# Altium schematic sheet gsm.SchDoc
size A; SheetNumber: 1; SheetTotal: 4
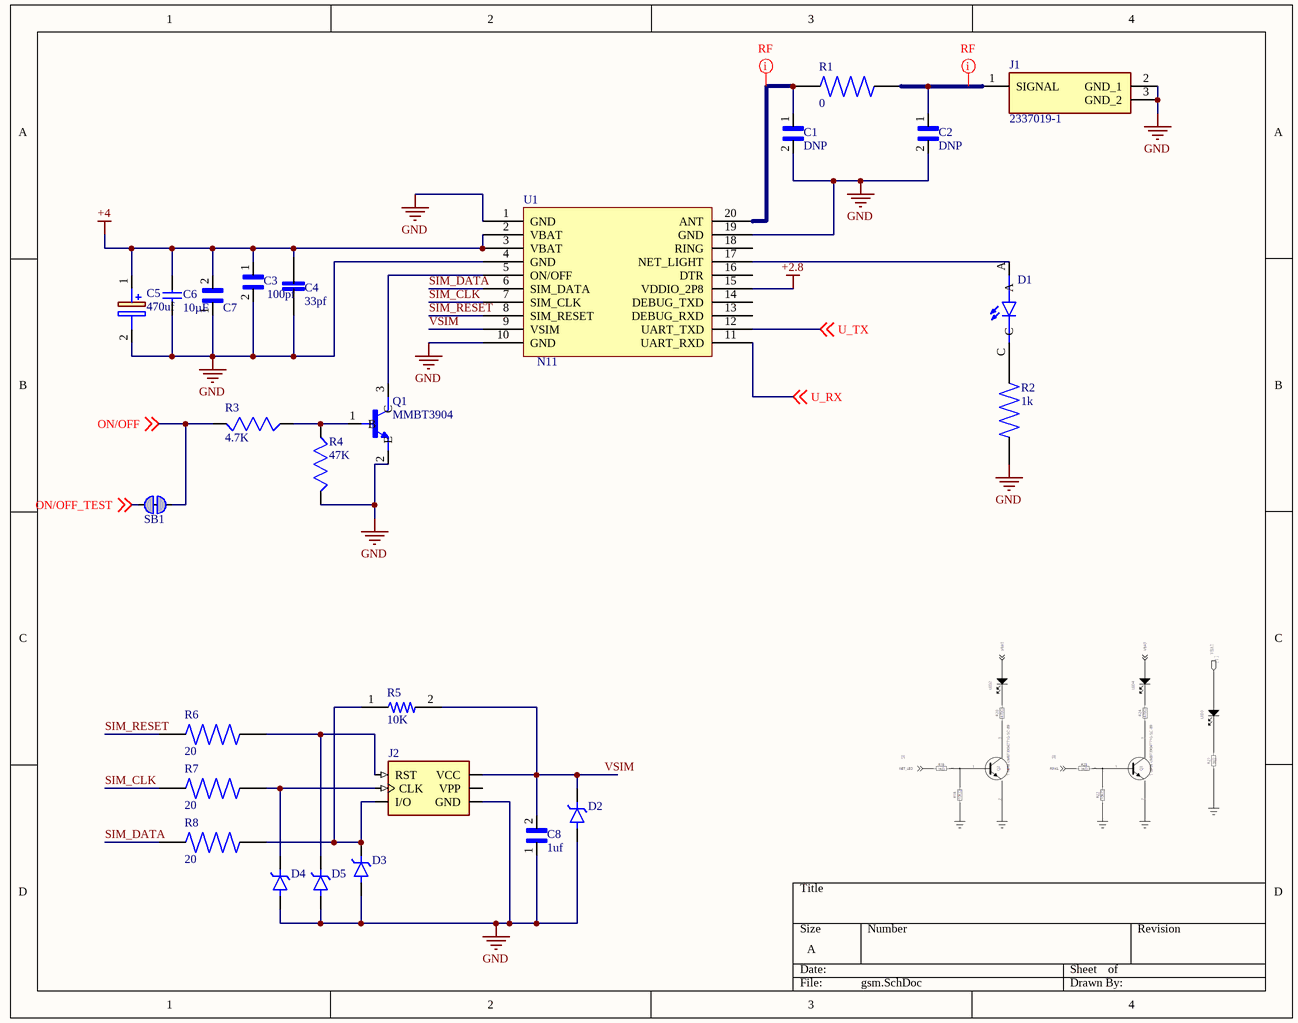
[diagram p0: gsm.SchDoc]

## Parts
C1  value DNP  [CAPC1608X90]  (hidden comment: C0603C474K8PACTU)
C2  value DNP  [CAPC1608X90]  (hidden comment: C0603C474K8PACTU)
C3  value 100pf  [CAPC1608X90]  (hidden comment: CC0603JPNPO9BN101)
C4  value 33pf  [CAPC1608X90]  (hidden comment: CC0603JPNPO9BN330)
C5  value 470uf  [CAPAE830X1050N]  (hidden comment: EDH477M6R3A9MAA)
C6  10µF  [CAP_0603]
C7  06033G104ZAT4A  [CAPC1608X90N]  (value not drawn)
C8  value 1uf  [CAPC1608X90N]  (hidden comment: EMK107B7105MA-T)
D1  LTST-C190KRKT  [LEDC1608X35N]  (value not drawn)
D2  ESD9X5.0ST5G  [SODFL1006X43N]  (value not drawn)
D3  ESD9X5.0ST5G  [SODFL1006X43N]  (value not drawn)
D4  ESD9X5.0ST5G  [SODFL1006X43N]  (value not drawn)
D5  ESD9X5.0ST5G  [SODFL1006X43N]  (value not drawn)
J1  2337019-1  [23370191]
J2  SIM8051-6-0-14-01-X-REVD  [GCT_SIM8051-6-0-14-01-X-REVD]  (value not drawn)
Q1  MMBT3904  [SOT95P240X120-3N]
R1  value 0  [RESC1607X60N]  (hidden comment: RC0603JR-070RL)
R2  value 1k  [RESC1608X55N]  (hidden comment: CR0603-FX-1001ELF)
R3  value 4.7K  [RESC1608X55]  (hidden comment: RC0603FR-0747KL)
R4  value 47K  [RESC1608X55]  (hidden comment: RC0603FR-0747KL)
R5  value 10K  [RESC1607X60N]  (hidden comment: RC0603FR-0710KL)
R6  value 20  [RESC1607X60N]  (hidden comment: RC0603FR-0720RL)
R7  value 20  [RESC1607X60N]  (hidden comment: RC0603FR-0720RL)
R8  value 20  [RESC1607X60N]  (hidden comment: RC0603FR-0720RL)
SB1  Solderbridge  [SOLDERBRIDGE_SHORTED]  (value not drawn)  (net tie, no BOM)
U1  This is Neoway N11 Module  [N11_20P]  (value not drawn)

## Nets
+2.8: U1.15(VDDIO_2P8)
+4: C3.1 C4.2 C5.1(+) C6.1 C7.2 U1.2(VBAT) U1.3(VBAT)
GND: C1.2 C2.2 C3.2 C4.1 C5.2(-) C6.2 C7.1 C8.1 D2.A D3.A D4.A D5.A J1.2(GND_1) J1.3(GND_2) J2.C5(GND) Q1.2(E) R2.1 R4.1 U1.1(GND) U1.4(GND) U1.10(GND) U1.19(GND)
ON/OFF: R3.1 SB1.1 ; off-sheet ON/OFF
ON/OFF_TEST: SB1.2 ; off-sheet ON/OFF_TEST
SIM_CLK: R7.1 U1.7(SIM_CLK)
SIM_DATA: R8.1 U1.6(SIM_DATA)
SIM_RESET: R6.1 U1.8(SIM_RESET)
U_RX: U1.11(UART_RXD) ; off-sheet U_RX
U_TX: U1.12(UART_TXD) ; off-sheet U_TX
VSIM: C8.2 D2.C(K) J2.C1(VCC) R5.2 U1.9(VSIM)
NetC1_1: C1.1 R1.1 U1.20(ANT)
NetC2_1: C2.1 J1.1(SIGNAL) R1.2
NetD1_A: D1.A U1.17(NET_LIGHT)
NetD1_C: D1.C R2.2
NetD3_C: D3.C(K) J2.C7(I/O) R5.1 R8.2
NetD4_C: D4.C(K) J2.C3(CLK) R7.2
NetD5_C: D5.C(K) J2.C2(RST) R6.2
NetQ1_1: Q1.1(B) R3.2 R4.2
NetQ1_3: Q1.3(C) U1.5(ON/OFF)

Not connected (* = marked no-connect by the designer): J2 C6(VPP); U1 13(DEBUG_RXD) 14(DEBUG_TXD) 16(DTR) 18(RING)

## Layout directives
net class RF: NetC1_1, NetC2_1

## Library data of the parts
C1 C2 = C0603C474K8PACTU: CAP, MLCC, X5R, 0.47UF, 10V, 0603; MF: {'manufacturer': u'KEMET'}; Availability: Unavailable; MP: C0603C474K8PACTU; Price: None; Package: None
C3 = CC0603JPNPO9BN101: 0603 100 pF 50 V Â±5% Tolerance NP0 SMT Multilayer Ceramic Capacitor; MF: {'manufacturer': u'Yageo'}; MP: CC0603JPNPO9BN101; Package: None; Price: None; Availability: Unavailable
C4 = CC0603JPNPO9BN330: 0603 33 pF 50 V Â±5 % Tolerance C0G/NP0 SMT Multilayer Ceramic Capacitor; MF: {'manufacturer': u'Yageo'}; Price: None; Package: None; Availability: Unavailable; MP: CC0603JPNPO9BN330
C5 = EDH477M6R3A9MAA: Capacitor Polarised; Manufacturer_Name: KEMET; Datasheet Link: https://content.kemet.com/datasheets/KEM_A4049_EDH.pdf; Height: 10.5mm; Manufacturer_Part_Number: EDH477M6R3A9MAA; Mouser Part Number: 80-EDH477M6R3A9MAA; Mouser Price/Stock: https://www.mouser.co.uk/ProductDetail/KEMET/EDH477M6R3A9MAA?qs=E9QF1UCAUX5I%2FnxgAi822A%3D%3D
C6 = CL10A106KP8NNNC: 10µF 10V Ceramic Capacitor X5R 0603 (1608 Metric) 0.063" L x 0.031" W (1.60mm x 0.80mm); Manufacturer: Samsung Electronics; Supplier 1: Digi-Key; Value: 10µF; Supplier Part Number 1: 1276-1192-1-ND; Part Number: CL10A106KP8NNNC
C7 = 06033G104ZAT4A: Cap Ceramic 0.1uF 25V Y5V -20% to 80% SMD 0603 85C T/R; MF: {'manufacturer': u'AVX'}; Availability: Unavailable; MP: 06033G104ZAT4A; Price: None; Package: None; Value: *
C8 = EMK107B7105MA-T: Ceramic Multilayer Capacitor; Capacitor Type:General Purpose; Capacitance:1ÂµF; Capacitance Tolerance:Â± 20%; Voltage Rating:16VDC; Capacitor Dielectric Type:Multilayer Ceramic; Package/Case:0603; Termination Type:SMD ;RoHS Compliant: Yes; MF: {'manufacturer': u'Taiyo Yuden'}; Price: None; Availability: Unavailable; MP: EMK107B7105MA-T; Package: None
D1 = LTST-C190KRKT: LED; SMD; 0603; red; 18-180mcd; 1.6x0.8x0.8mm; 130Â°; 1.6Ã·2.4V; 20mA; MF: {'manufacturer': u'Lite-On Inc.'}; Price: None; Package: None; Availability: Unavailable; MP: LTST-C190KRKT
D2-D5 = ESD9X5.0ST5G: ESD9X5.0S: ESD Protection Single Diode In Ultra Small SOD-923 Package; MF: {'manufacturer': u'ON Semiconductor'}; Price: None; Package: None; Availability: Unavailable; MP: ESD9X5.0ST5G; Value: *
J1 = 2337019-1: Connector; Manufacturer_Name: TE Connectivity; Datasheet Link: https://www.te.com/commerce/DocumentDelivery/DDEController?Action=showdoc&DocId=Customer+Drawing%7FC-2337019%7FA3%7Fpdf%7FEnglish%7FENG_CD_C-2337019_A3.pdf%7F2337019-1; Height: 1.4mm; Manufacturer_Part_Number: 2337019-1; Mouser Part Number: 571-2337019-1; Mouser Price/Stock: https://www.mouser.co.uk/ProductDetail/TE-Connectivity/2337019-1?qs=l4Gc20tDgJIuN7nS9rJkJw%3D%3D; Arrow Part Number: 2337019-1; Arrow Price/Stock: https://www.arrow.com/en/products/2337019-1/te-connectivity?region=europe
J2 = SIM8051-6-0-14-01-X-REVD: Nano SIM Card Connector, Push-Pull Type, 6 Pin, SMT, Profile 1.35mm; MF: {'manufacturer': u'Global Connector Technology'}; Price: None; Package: None; Availability: Unavailable; MP: SIM8051-6-0-14-01-X-REVD; Value: *
Q1 = MMBT3904: MMBT3904 Series 40 V CE Breakdown 0.2 A NPN General Purpose Amplifier - SOT-23; MF: {'manufacturer': u'ON Semiconductor'}; MP: MMBT3904; Value: *; Package: None; Price: None; Availability: Unavailable
R1 = RC0603JR-070RL: Thick film general purpose; MF: {'manufacturer': u'Yageo'}; Package: None; MP: RC0603JR-070RL; Price: None; Availability: Unavailable
R2 = CR0603-FX-1001ELF: Resistor; Thick Film; Res 1 Kilohms; Pwr-Rtg 0.1 W; Tol 1%; SMT; 0603; MF: {'manufacturer': u'Bourns'}; Availability: Unavailable; MP: CR0603-FX-1001ELF; Price: None; Package: None
R3 R4 = RC0603FR-0747KL: RC Series 0603 0.1 W 47 kOhms 1% Â±100 ppm/Â°C SMT Thick Film Chip Resistor; MF: {'manufacturer': u'Yageo'}; MP: RC0603FR-0747KL; Package: None; Price: None; Availability: Unavailable
R5 = RC0603FR-0710KL: YAGEO RC0603FR-0710KL / RESISTOR 10K 1/10W 1% 0603 YAG; MF: {'manufacturer': u'Yageo'}; Availability: Unavailable; MP: RC0603FR-0710KL; Price: None; Package: None
R6-R8 = RC0603FR-0720RL: RC Series 0603 0.1 W 20 Ohms 1% Â±100 ppm/Â°C SMT Thick Film Chip Resistor; MF: {'manufacturer': u'Yageo'}; Price: None; Availability: Unavailable; MP: RC0603FR-0720RL; Package: None
SB1 = SOLDERBRIDGE_SHORTED: Shorted Solderbridge; Part Number: Solderbridge Shorted; Artikkelnr Noca: N.A.; Manufacturer: *; Manufacturer Part Number: *; Datasheet: *; LatestRevisionDate: 2012-08-07; Pin Count: 2; Publisher: Nordic Semiconductor; Published: 2012-08-07; Value: Solderbridge; Note: *; Supplier: *; Supplier part number: *; 2nd source Supplier: *; 2nd source part number: *; Footprint Doc: Solderbridge_Shorted; Artikkelnr Simpro: N.A.
U1 = N11: N11 is a low-power consumption and high-performance GSM/GPRS module. Its dimensions are 13.8 x 15.8 x 2.5 mm. Its pins are packaged in LGA, which reduces product area.